# Altium schematic sheet Photo-Diode Board.SchDoc
size A
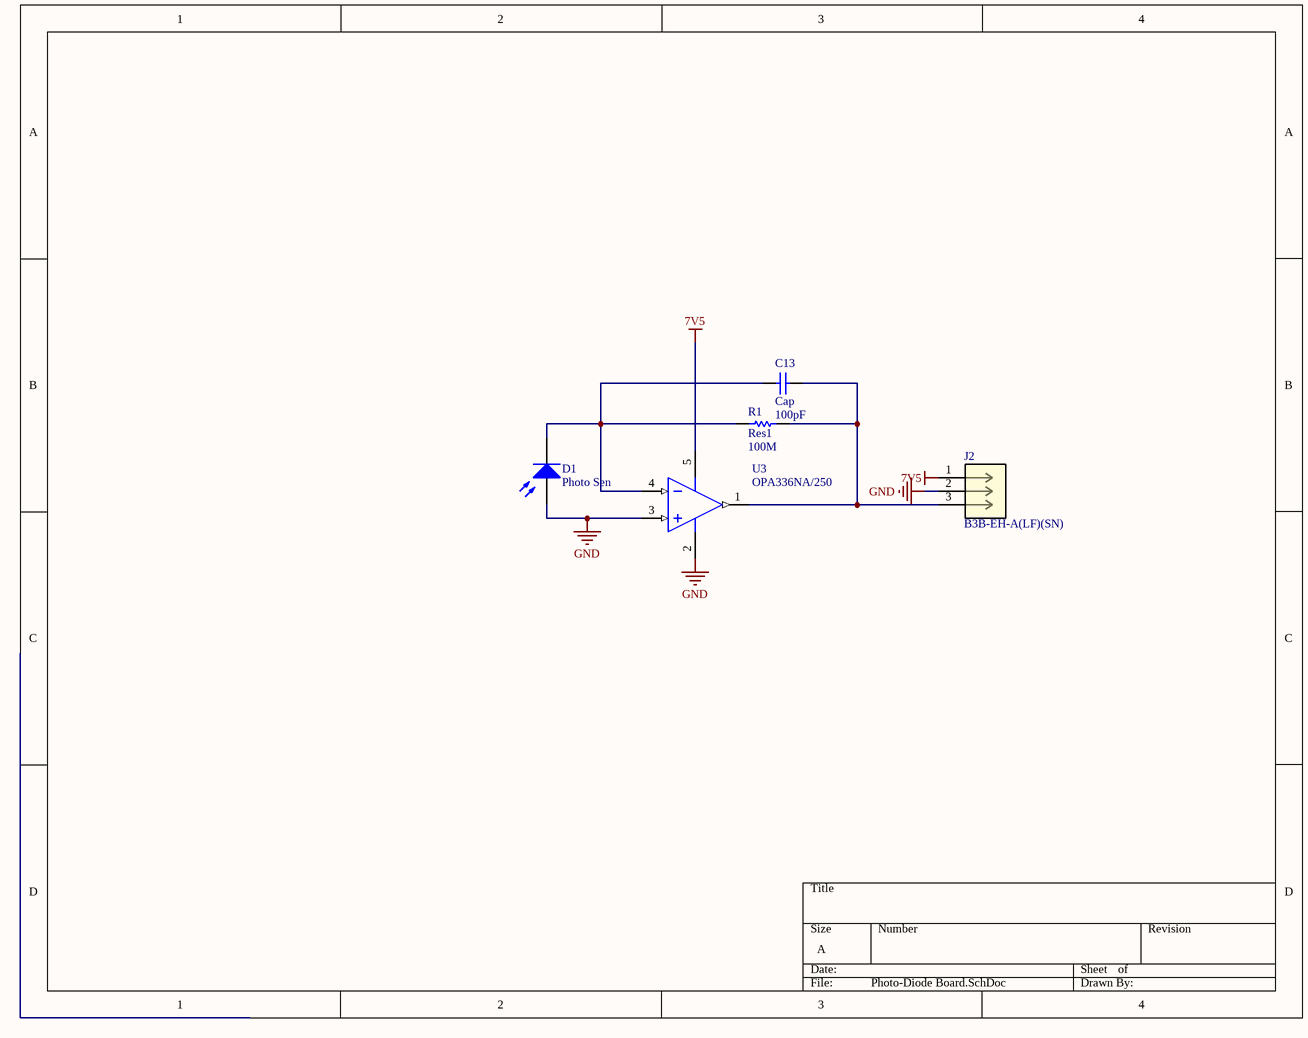
[diagram p0: Photo-Diode Board.SchDoc]

## Parts
C13  Cap  value 100pF  [0402-A]
D1  Photo Sen  [PIN2]
J2  B3B-EH-A(LF)(SN)  [CONN3_B3B-EH-A(LF)(SN)_JST]
R1  Res1  value 100M  [1608[0603]]
U3  OPA336NA/250  [DBV0005A_M]

## Nets
7V5: J2.1 U3.5(V+)
GND: D1.1(A) J2.2 U3.2(V-) U3.3(IN+)
NetC13_1: C13.1 D1.2(K) R1.1 U3.4(IN-)
NetC13_2: C13.2 J2.3 R1.2 U3.1(OUT)

## Library data of the parts
C13 = Cap: Capacitor; Published: 8-Jun-2000; LatestRevisionDate: 17-Jul-2002; LatestRevisionNote: Re-released for DXP Platform.; PackageReference: RAD-0.3; Publisher: Altium Limited; PackageDescription: Radial Cap, Thru-Hole; 2 Leads; 0.3 in Pin Spacing
D1 = Photo Sen: Photosensitive Diode; Published: 24-Mar-1999; LatestRevisionDate: 17-Jul-2002; LatestRevisionNote: Re-released for DXP Platform.; PackageReference: PIN2; Publisher: Altium Limited
J2 = B3B-EH-A(LF)(SN): No Description Available; Vendor: JST; Built_By: EMA_Kyle; SourceLibrary: JST_2020-07-31; Datasheet: http://www.jst-mfg.com/product/pdf/eng/eEH.pdf; Manufacturer_Part_Number: B3B-EH-A(LF)(SN); Copyright: Copyright (C) 2018 Accelerated Designs. All rights reserved; RefDes: RefDes; Type: DEV
R1 = Res1: Resistor; Published: 8-Jun-2000; LatestRevisionDate: 17-Jul-2002; LatestRevisionNote: Re-released for DXP Platform.; PackageReference: AXIAL-0.3; Publisher: Altium Limited; PackageDescription: Axial Device, Thru-Hole; 2 Leads; 0.3 in Pin Spacing
U3 = CMP-0272-00910-3: Single-Supply, MicroPower CMOS Operational Amplifier MicroAmplifier(TM) Series, 2.3 to 5.5 V, -55 to 125 degC, 5-pin SOT23 (DBV5), Green (RoHS & no Sb/Br); Manufacturer: Texas Instruments; Slew Rate(Typ)(V/us): 0.03; Iq per channel(Max)(mA): 0.032; Number of Channels: 1; Offset Drift(Typ)(uV/C): 1.5; IIB(Max)(pA): 10; Total Supply Voltage(Max)(+5V is 5, +/-5V is 10): 5.5; Vio (25C)(Max)(mV): 0.5; CMRR(Min)(dB): 76; Total Supply Voltage(Min)(+5V is 5, +/-5V is 10): 2.3; Sub Family: Low Input Bias Current Amp (<=10pA), Low Offset Voltage Amplifier (<=500uV), Low Power Amp (<=500uA), Low Supply Voltage Amplifier (<=2.7V), Precision Amplifier; Vn at 1kHz(Typ)(nV/rtHz): 40; DatasheetVersion: SBOS068C; ComponentLink1URL: http://www.ti.com/; ComponentLink2Description: Datasheet; PackageReference: DBV0005A; ComponentLink3Description: Package Specification; ComponentLink2URL: http://www.ti.com/general/docs/lit/getliterature.tsp?genericPartNumber=OPA336&fileType=pdf; Mounting Technology: Surface Mount; Eco-Plan: Green (RoHS & no Sb/Br); Code_JEDEC: MO-178; ComponentLink3URL: http://www.ti.com/litv/pdf/mpds018i; PackageDescription: 5-Pin Plastic Small Outline, Body 1.6 x 2.9 mm, Pitch 0.95 mm; PartNumber: OPA336NA/250; PackageVersion: 4073253-4/K, 03/2006; ComponentLink1Description: Manufacturer URL